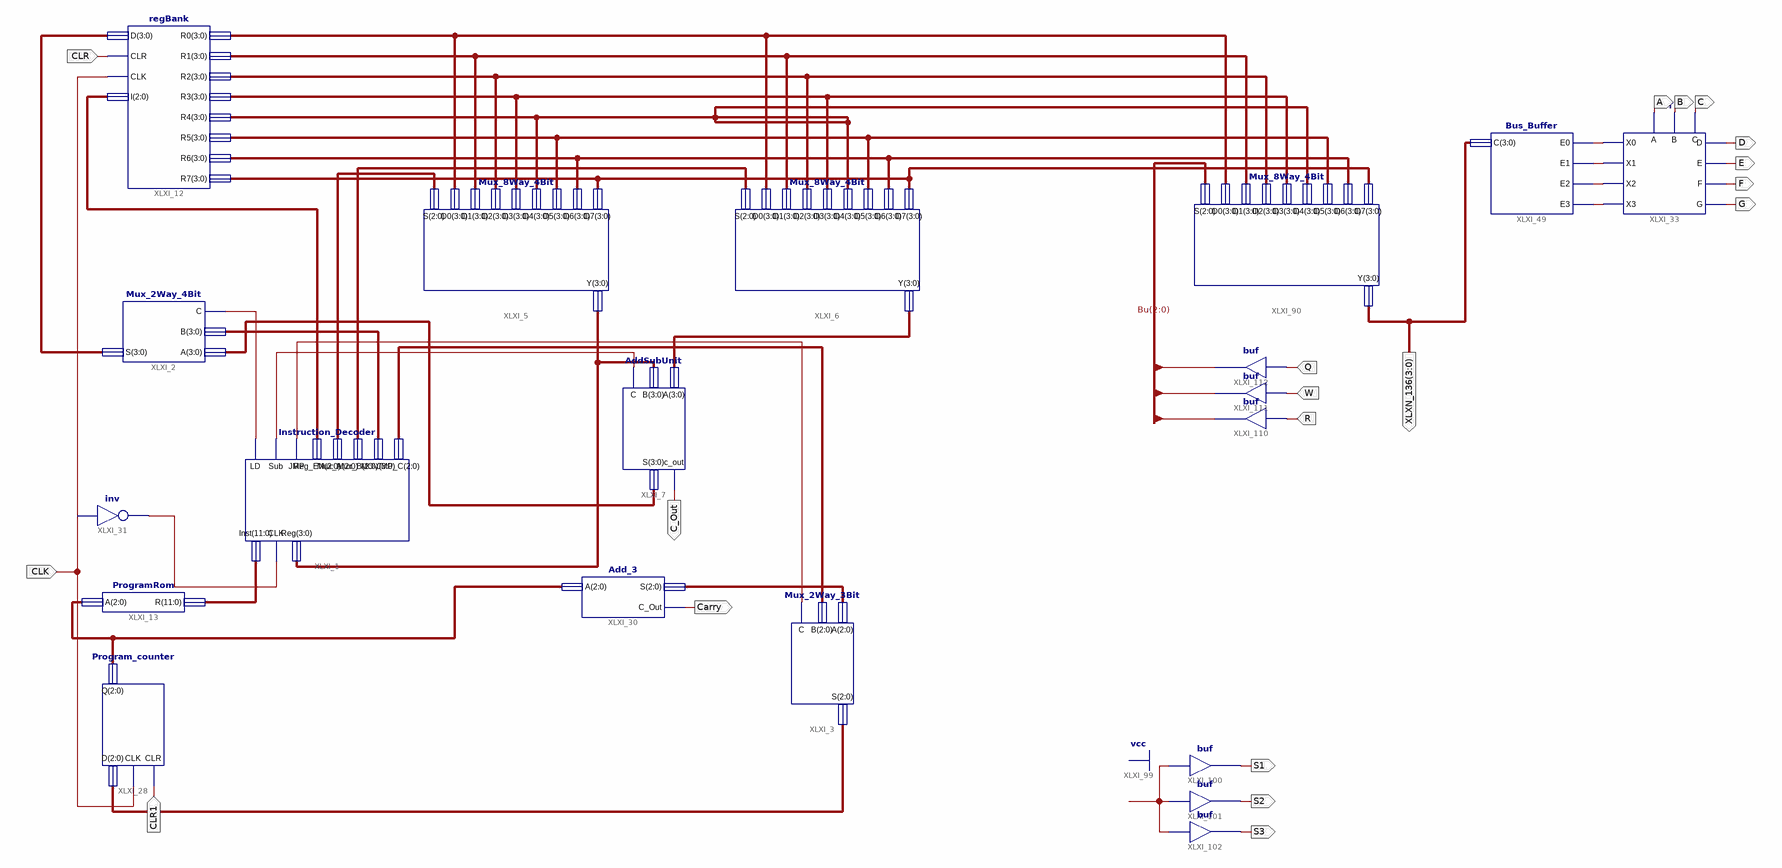
[diagram p0: schematic sheet 1]
// Xilinx ISE schematic NanoProcessor.sch (spartan3e) as structural Verilog: 20 symbols, 19 ports
module NanoProcessor (
  input  CLR,
  input  CLR1,
  input  CLK,
  input  Q,
  input  W,
  input  R,
  output C_Out,
  output Carry,
  output [3:0] XLXN_136,
  output A,
  output B,
  output C,
  output D,
  output E,
  output F,
  output G,
  output S1,
  output S2,
  output S3
);

  wire s, XLXN_28, XLXN_32, XLXN_53, XLXN_54, XLXN_55, XLXN_56, XLXN_57;
  wire [2:0] Bu, count, countplus, Ma, Mb, muxb, muxout_40, regEN;
  wire [3:0] addsubA, addsubB, addsubout, E0, E1, E2, E3, E4, E5, E6, E7, XLXN_22, XLXN_24;
  wire [11:0] instruction;

  Instruction_Decoder XLXI_1 (
    .CLK(XLXN_53), .Inst(instruction), .JMP(XLXN_32), .JMP_C(muxb), .LD(XLXN_28), .MOV(XLXN_24), .Mux_A(Ma),
    .Mux_B(Mb), .Reg(addsubB), .Reg_EN(regEN), .Sub(s));
  Mux_2Way_4Bit XLXI_2 (.A(addsubout), .B(XLXN_24), .C(XLXN_28), .S(XLXN_22));
  Mux_2Way_3Bit XLXI_3 (.A(countplus), .B(muxb), .C(XLXN_32), .S(muxout_40));
  Mux_8Way_4Bit XLXI_5 (.D0(E0), .D1(E1), .D2(E2), .D3(E3), .D4(E4), .D5(E5), .D6(E6), .D7(E7), .S(Ma), .Y(addsubB));
  Mux_8Way_4Bit XLXI_6 (.D0(E0), .D1(E1), .D2(E2), .D3(E3), .D4(E4), .D5(E5), .D6(E6), .D7(E7), .S(Mb), .Y(addsubA));
  AddSubUnit XLXI_7 (.A(addsubA), .B(addsubB), .C(s), .c_out(C_Out), .S(addsubout));
  regBank XLXI_12 (
    .CLK(CLK), .CLR(CLR), .D(XLXN_22), .I(regEN), .R0(E0), .R1(E1), .R2(E2), .R3(E3), .R4(E4), .R5(E5),
    .R6(E6), .R7(E7));
  ProgramRom XLXI_13 (.A(count), .R(instruction));
  Program_counter XLXI_28 (.CLK(CLK), .CLR(CLR1), .D(muxout_40), .Q(count));
  Add_3 XLXI_30 (.A(count), .C_Out(Carry), .S(countplus));
  not XLXI_31 (XLXN_53, CLK);
  Bus_Buffer XLXI_49 (.C(XLXN_136), .E0(XLXN_54), .E1(XLXN_55), .E2(XLXN_56), .E3(XLXN_57));
  LUT XLXI_33 (.A(A), .B(B), .C(C), .D(D), .E(E), .F(F), .G(G), .X0(XLXN_54), .X1(XLXN_55), .X2(XLXN_56), .X3(XLXN_57));
  Mux_8Way_4Bit XLXI_90 (.D0(E0), .D1(E1), .D2(E2), .D3(E3), .D4(E4), .D5(E5), .D6(E6), .D7(E7), .S(Bu), .Y(XLXN_136));
  buf XLXI_100 (S1, 1'b1);
  buf XLXI_101 (S2, 1'b1);
  buf XLXI_102 (S3, 1'b1);
  buf XLXI_110 (Bu[2], R);
  buf XLXI_111 (Bu[1], W);
  buf XLXI_112 (Bu[0], Q);
endmodule
